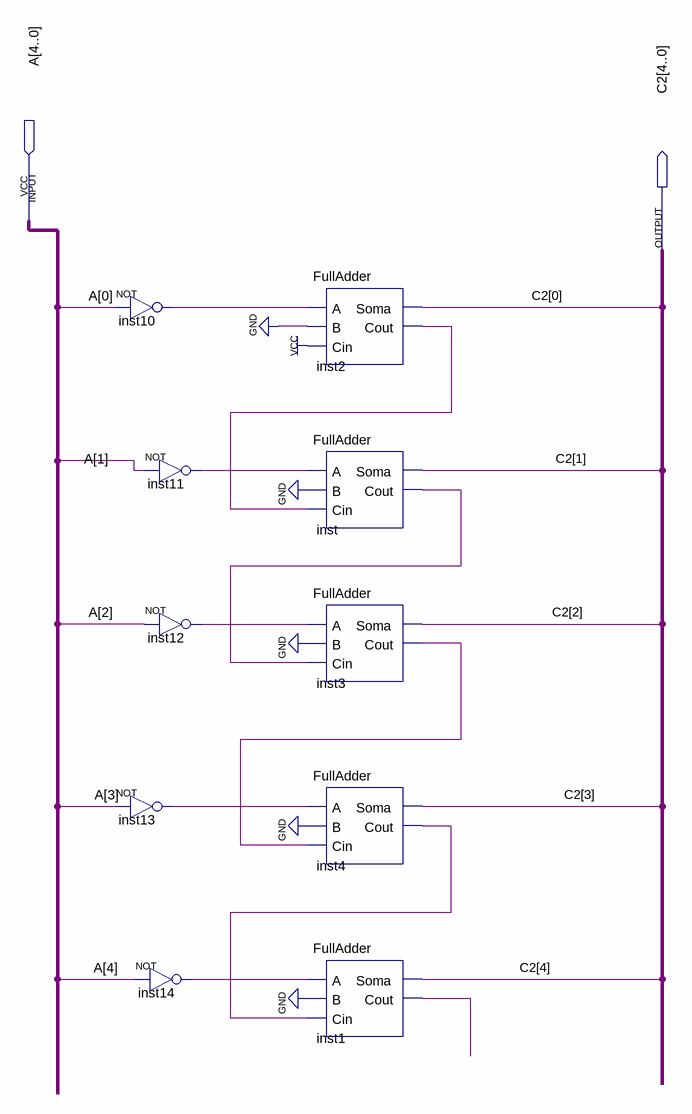
[diagram p0: schematic sheet]
// Quartus schematic C2_5Bits.bdf as structural Verilog: 10 symbols, 2 pins
module C2_5Bits (
  input  [4:0] A,
  output [4:0] C2
);

  wire inst1_cout, inst2_cout, inst3_cout, inst4_cout, inst10_out, inst11_out, inst12_out, inst13_out,
       inst14_out, inst_cout;

  not inst10 (inst10_out, A[0]);
  not inst11 (inst11_out, A[1]);
  not inst12 (inst12_out, A[2]);
  not inst13 (inst13_out, A[3]);
  not inst14 (inst14_out, A[4]);
  FullAdder inst2 (.A(inst10_out), .B(1'b0), .Cin(1'b1), .Soma(C2[0]), .Cout(inst2_cout));
  FullAdder inst (.A(inst11_out), .B(1'b0), .Cin(inst2_cout), .Soma(C2[1]), .Cout(inst_cout));
  FullAdder inst3 (.A(inst12_out), .B(1'b0), .Cin(inst_cout), .Soma(C2[2]), .Cout(inst3_cout));
  FullAdder inst4 (.A(inst13_out), .B(1'b0), .Cin(inst3_cout), .Soma(C2[3]), .Cout(inst4_cout));
  FullAdder inst1 (.A(inst14_out), .B(1'b0), .Cin(inst4_cout), .Soma(C2[4]), .Cout(inst1_cout));
endmodule
